# Altium schematic sheet MCU.SchDoc
size 420 x 297 mm; SheetNumber: 6; SheetTotal: 6
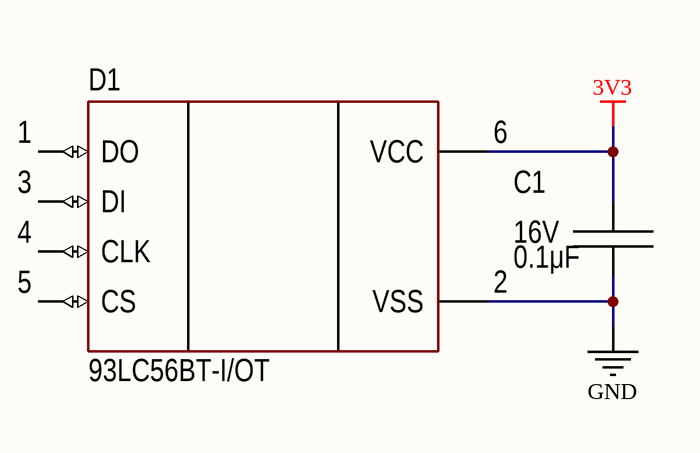
[diagram p0: MCU.SchDoc]

## Parts
C1  value 0.1μF  Voltage: 16V  [CAP: 0805]
D1  PartNumber: 93LC56BT-I/OT  [SOT23-6]

## Nets
3V3: C1.2 D1.6(VCC)
GND: C1.1 D1.2(VSS)

Not connected (* = marked no-connect by the designer): D1 1(DO) 3(DI) 4(CLK) 5(CS)

## Notes on the sheet
- Подп. и дата
- Инв. № дубл.
- Взам. инв. №
- Инв. № подл.
- Изм.
- Лист
- № докум.
- Подп.
- Дата
- 2.106-A3
- Копировал
- Формат А3

## Library data of the parts
C1 = Ceramic_0805: Manufacturer: Yageo; PartNumber: CC0805KRX7R7BB104; ValueManufacturerPartNumber: Ceramic capacitor, 0.1μF, X7R, ±10%, 16V, 0805, -55...+125°C; TypeCapacitor: Ceramic capacitor; Tolerance: ±10%; TypeDielectric: X7R; Package: 0805; HelpURL: https://www.digikey.com/product-detail/en/yageo/CC0805KRX7R7BB104/311-1142-1-ND/303052; Temperature: -55...+125°C
D1 = 93LC56BT: EEPROM; Manufacturer: Microchip Technology; ValueManufacturerPartNumber: IC memory, EEPROM, 2KB (256x8), 2 MHz, SPI, 2.5...5.5V, -40...+85°C, SOT-23-6; Supply: 2.5...5.5V; Speed: 2 MHz; InterfaceData: SPI; MemorySize: 2KB (256x8); HelpURL: https://www.digikey.com/product-detail/en/microchip-technology/93LC56BT-I-OT/93LC56BT-I-OTCT-ND/857632; Package: SOT-23-6; ComponentType: IC memory; Temperature: -40...+85°C; MemoryType: EEPROM